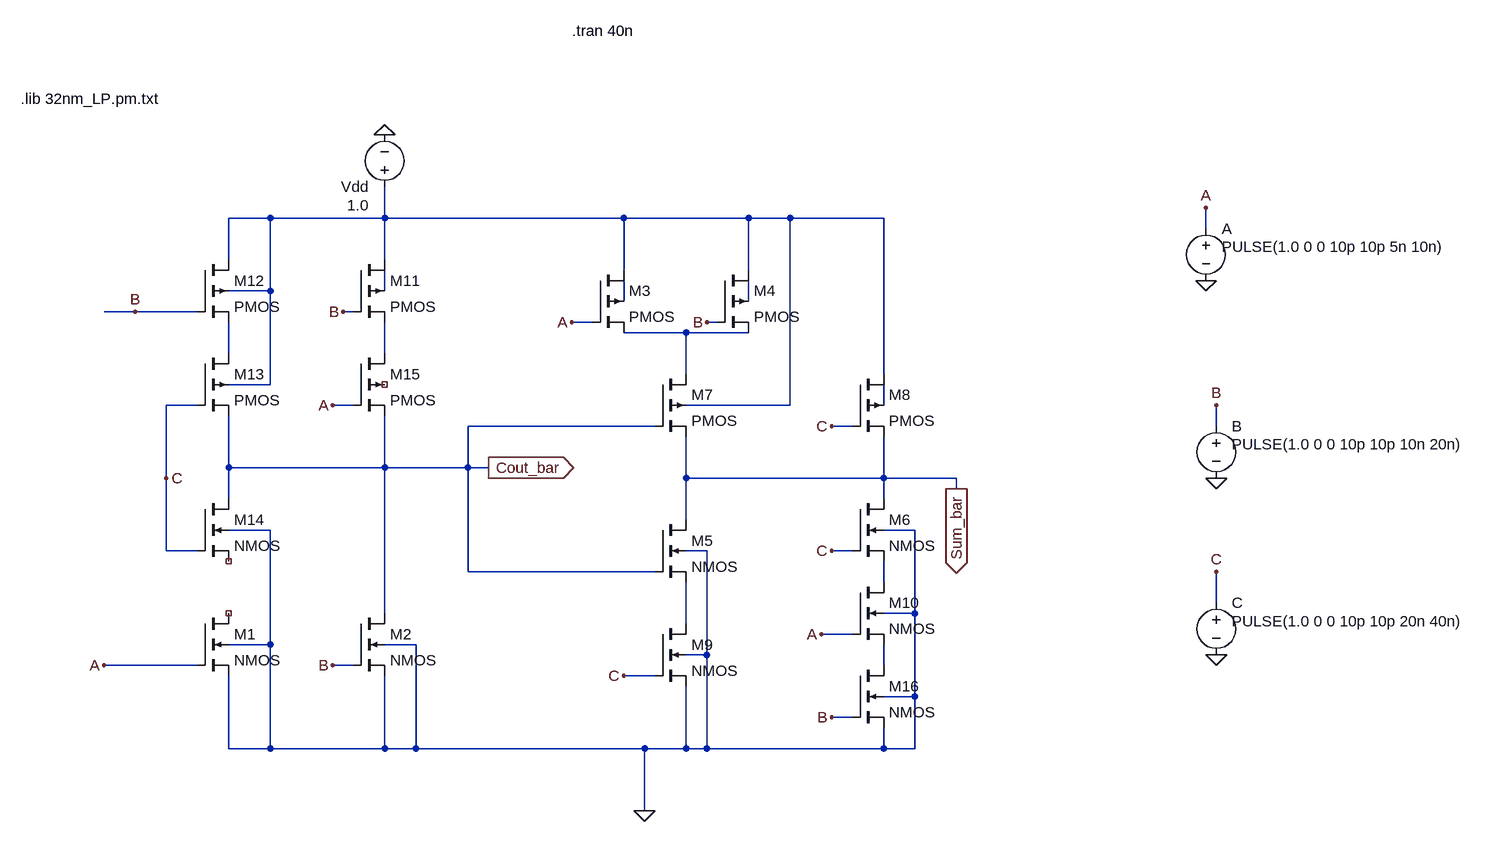
[diagram p0: schematic AMA1_45nm.asc]
AMA1_45nm.asc, the LTspice schematic file:
Version 4
SHEET 1 1044 692
WIRE -816 -240 -880 -240
WIRE -640 -240 -640 -288
WIRE -640 -240 -816 -240
WIRE -272 -240 -640 -240
WIRE -80 -240 -272 -240
WIRE -16 -240 -80 -240
WIRE 128 -240 -16 -240
WIRE 624 -224 624 -256
WIRE -880 -176 -880 -240
WIRE -640 -176 -640 -240
WIRE -272 -160 -272 -240
WIRE -80 -160 -80 -240
WIRE -816 -128 -816 -240
WIRE -816 -128 -880 -128
WIRE -640 -128 -640 -160
WIRE -272 -112 -272 -144
WIRE -80 -112 -80 -144
WIRE -1024 -96 -1072 -96
WIRE -928 -96 -1024 -96
WIRE -688 -96 -704 -96
WIRE -320 -80 -352 -80
WIRE -128 -80 -144 -80
WIRE -176 -64 -272 -64
WIRE -80 -64 -176 -64
WIRE -880 -32 -880 -80
WIRE -640 -32 -640 -80
WIRE -176 0 -176 -64
WIRE 128 0 128 -240
WIRE -816 16 -816 -128
WIRE -816 16 -880 16
WIRE -928 48 -976 48
WIRE -688 48 -720 48
WIRE -16 48 -16 -240
WIRE -16 48 -176 48
WIRE 128 48 128 16
WIRE -224 80 -512 80
WIRE 80 80 48 80
WIRE 640 80 640 48
WIRE -880 144 -880 64
WIRE -640 144 -640 64
WIRE -640 144 -880 144
WIRE -512 144 -512 80
WIRE -512 144 -640 144
WIRE -480 144 -512 144
WIRE -976 160 -976 48
WIRE -176 160 -176 96
WIRE 128 160 128 96
WIRE 128 160 -176 160
WIRE 240 160 128 160
WIRE 240 176 240 160
WIRE -880 192 -880 144
WIRE 128 192 128 160
WIRE -176 224 -176 160
WIRE -816 240 -880 240
WIRE 176 240 128 240
WIRE -976 272 -976 160
WIRE -928 272 -976 272
WIRE -144 272 -176 272
WIRE 80 272 48 272
WIRE -512 304 -512 144
WIRE -224 304 -512 304
WIRE 128 320 128 288
WIRE 640 352 640 304
WIRE -640 368 -640 144
WIRE 176 368 176 240
WIRE 176 368 128 368
WIRE -176 384 -176 320
WIRE 80 400 32 400
WIRE -816 416 -816 240
WIRE -816 416 -880 416
WIRE -592 416 -640 416
WIRE -144 432 -144 272
WIRE -144 432 -176 432
WIRE -928 448 -1072 448
WIRE -688 448 -720 448
WIRE 128 448 128 416
WIRE -224 464 -272 464
WIRE 176 496 176 368
WIRE 176 496 128 496
WIRE 80 528 48 528
WIRE -880 576 -880 464
WIRE -816 576 -816 416
WIRE -816 576 -880 576
WIRE -640 576 -640 464
WIRE -640 576 -816 576
WIRE -592 576 -592 416
WIRE -592 576 -640 576
WIRE -240 576 -592 576
WIRE -176 576 -176 480
WIRE -176 576 -240 576
WIRE -144 576 -144 432
WIRE -144 576 -176 576
WIRE 128 576 128 544
WIRE 128 576 -144 576
WIRE 176 576 176 496
WIRE 176 576 128 576
WIRE -240 672 -240 576
FLAG -240 672 0
FLAG -480 144 Cout_bar
IOPIN -480 144 Out
FLAG 240 176 Sum_bar
IOPIN 240 176 Out
FLAG 624 -144 0
FLAG 640 160 0
FLAG 640 432 0
FLAG 624 -256 A
FLAG 640 48 B
FLAG 640 304 C
FLAG -640 -368 0
FLAG -1024 -96 B
FLAG -704 -96 B
FLAG -720 448 B
FLAG -144 -80 B
FLAG 48 528 B
FLAG -1072 448 A
FLAG -720 48 A
FLAG 32 400 A
FLAG -352 -80 A
FLAG -976 160 C
FLAG 48 80 C
FLAG 48 272 C
FLAG -272 464 C
SYMBOL nmos4 -928 368 R0
SYMATTR InstName M1
SYMATTR Value2 l=45n w=1u
SYMBOL nmos4 -224 224 R0
SYMATTR InstName M5
SYMATTR Value2 l=45n w=1u
SYMBOL pmos4 -224 0 R0
SYMATTR InstName M7
SYMATTR Value2 l=45n w=2u
SYMBOL pmos4 80 0 R0
SYMATTR InstName M8
SYMATTR Value2 l=45n w=2u
SYMBOL pmos4 -688 -176 R0
SYMATTR InstName M11
SYMATTR Value2 l=45n w=2u
SYMBOL pmos4 -928 -176 R0
SYMATTR InstName M12
SYMATTR Value2 l=45n w=2u
SYMBOL voltage 624 -240 R0
WINDOW 3 24 44 Left 2
WINDOW 123 0 0 Left 0
WINDOW 39 0 0 Left 0
SYMATTR Value PULSE(1.0 0 0 10p 10p 5n 10n)
SYMATTR InstName A
SYMBOL voltage 640 64 R0
WINDOW 3 24 44 Left 2
WINDOW 123 0 0 Left 0
WINDOW 39 0 0 Left 0
SYMATTR Value PULSE(1.0 0 0 10p 10p 10n 20n)
SYMATTR InstName B
SYMBOL voltage 640 336 R0
WINDOW 3 24 44 Left 2
WINDOW 123 0 0 Left 0
WINDOW 39 0 0 Left 0
SYMATTR Value PULSE(1.0 0 0 10p 10p 20n 40n)
SYMATTR InstName C
SYMBOL voltage -640 -272 R180
WINDOW 3 24 -12 Left 2
WINDOW 123 0 0 Left 0
WINDOW 39 0 0 Left 0
SYMATTR Value 1.0
SYMATTR InstName Vdd
SYMBOL pmos4 -688 -32 R0
SYMATTR InstName M15
SYMATTR Value2 l=45n w=2u
SYMBOL pmos4 -928 -32 R0
SYMATTR InstName M13
SYMATTR Value2 l=45n w=2u
SYMBOL nmos4 -928 192 R0
SYMATTR InstName M14
SYMATTR Value2 l=45n w=1u
SYMBOL nmos4 -688 368 R0
SYMATTR InstName M2
SYMATTR Value2 l=45n w=1u
SYMBOL pmos4 -320 -160 R0
SYMATTR InstName M3
SYMATTR Value2 l=45n w=2u
SYMBOL pmos4 -128 -160 R0
SYMATTR InstName M4
SYMATTR Value2 l=45n w=2u
SYMBOL nmos4 -224 384 R0
SYMATTR InstName M9
SYMATTR Value2 l=45n w=1u
SYMBOL nmos4 80 320 R0
SYMATTR InstName M10
SYMATTR Value2 l=45n w=1u
SYMBOL nmos4 80 448 R0
SYMATTR InstName M16
SYMATTR Value2 l=45n w=1u
SYMBOL nmos4 80 192 R0
SYMATTR InstName M6
SYMATTR Value2 l=45n w=1u
TEXT -1200 -424 Left 2 !.lib 32nm_LP.pm.txt
TEXT -352 -528 Left 2 !.tran 40n

The netlist it stands for:
* AMA1_45nm.asc
M1 NC_01 A 0 0 NMOS l=45n w=1u
M5 Sum_bar Cout_bar N010 0 NMOS l=45n w=1u
M7 N005 Cout_bar Sum_bar N001 PMOS l=45n w=2u
M8 N001 C Sum_bar N008 PMOS l=45n w=2u
M11 N001 B N007 N002 PMOS l=45n w=2u
M12 N001 B N006 N001 PMOS l=45n w=2u
V§A A 0 PULSE(1.0 0 0 10p 10p 5n 10n)
V§B B 0 PULSE(1.0 0 0 10p 10p 10n 20n)
V§C C 0 PULSE(1.0 0 0 10p 10p 20n 40n)
Vdd N001 0 1.0
M15 N007 A Cout_bar NC_02 PMOS l=45n w=2u
M13 N006 C Cout_bar N001 PMOS l=45n w=2u
M14 Cout_bar C NC_03 0 NMOS l=45n w=1u
M2 Cout_bar B 0 0 NMOS l=45n w=1u
M3 N001 A N005 N003 PMOS l=45n w=2u
M4 N001 B N005 N004 PMOS l=45n w=2u
M9 N010 C 0 0 NMOS l=45n w=1u
M10 N009 A N011 0 NMOS l=45n w=1u
M16 N011 B 0 0 NMOS l=45n w=1u
M6 Sum_bar C N009 0 NMOS l=45n w=1u
.model NMOS NMOS
.model PMOS PMOS
.lib standard.mos
.lib 32nm_LP.pm.txt
.tran 40n
.backanno
.end